# EAGLE design sensorandps (EAGLE 5.10)
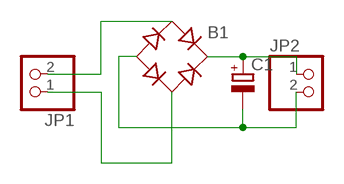
[diagram p0: schematic, sheet 1]

## Parts
B1  RB1A  [RB1A]
C1  CPOL-EUE7.5-16  [E7,5-16]
JP1  PINHD-1X2  [1X02]
JP2  PINHD-1X2  [1X02]

## Nets
N$1: B1.AC1 JP1.2
N$2: B1.AC2 JP1.1
N$3: B1.+ C1.+ JP2.1
N$4: B1.- C1.- JP2.2

## Library data of the parts
B1 = rectifier:RB1A: RECTIFIER 1 A
C1 = rcl:CPOL-EU: POLARIZED CAPACITOR, European symbol
JP1 JP2 = pinhead:PINHD-1X2: PIN HEADER

## Board
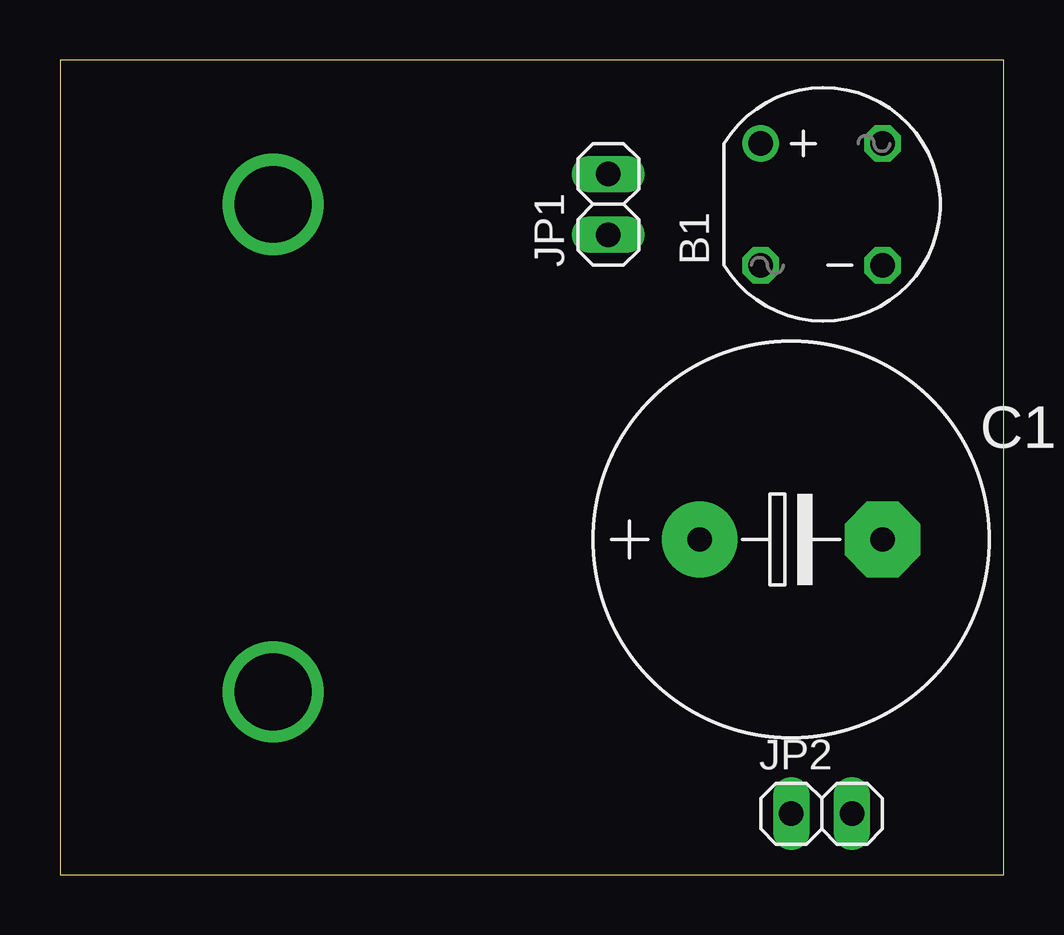
[diagram p1: board, top side]
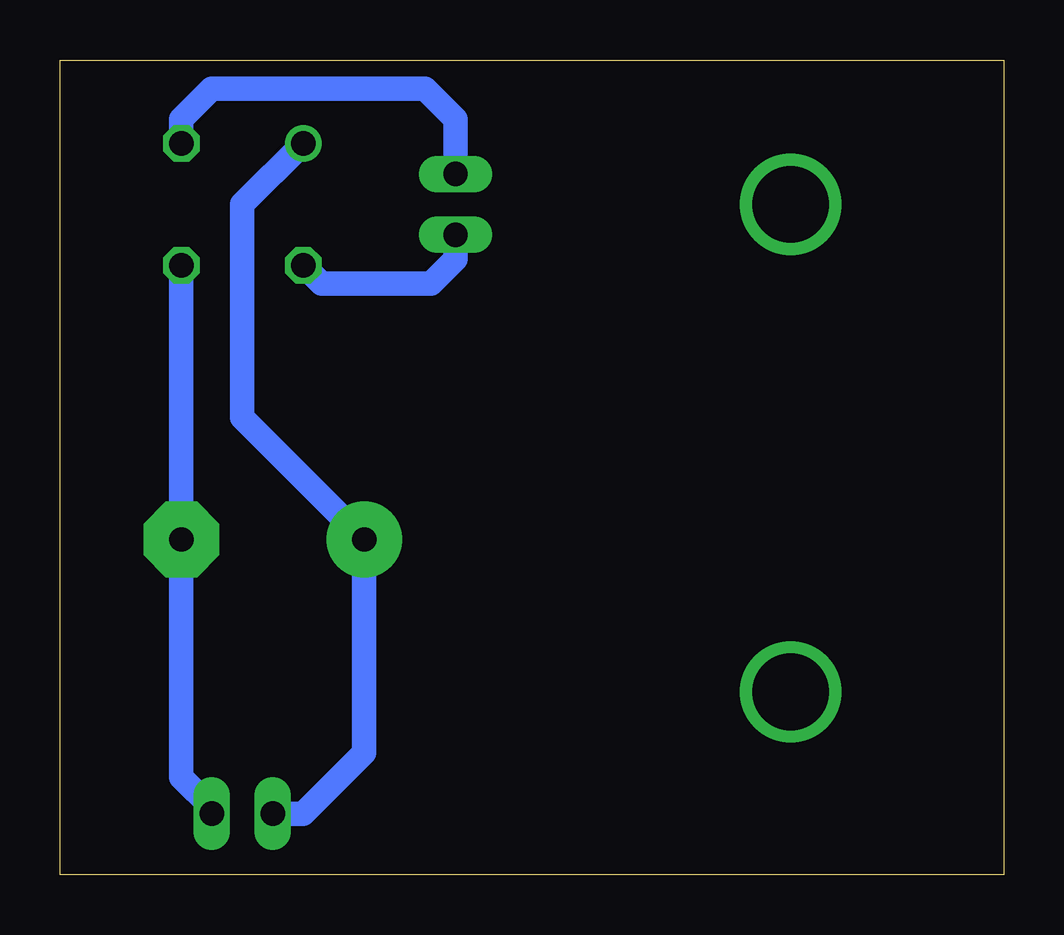
[diagram p2: board, bottom side, seen from below]

Size 39.35 x 33.96 mm. Coordinates in mm from the lower left corner, seen from the top.
Outline: 0,0 39.35,0 39.35,33.96 0,33.96 0,0
Copper layers (1*16): Top 0.035mm / dielectric 1.5mm / Bottom 0.035mm
Design rules "default": minimum track width 10mil, minimum drill 24mil, track to track 8mil, track to pad 8mil, pad to pad 8mil, via to via 8mil, smd to smd 8mil, copper to edge 40mil, drill to drill 8mil, minimum pad ring 10mil, minimum via ring 8mil, stop-mask expansion 4mil, vias tented up to drill 0mil, thermal gap 10mil

### Footprints (pad centres in the part's own frame; a part is rotated, then mirrored left to right if it is on the bottom)
RB1A = drill 1.016 round: + -2.54,2.54 | drill 1.016 octagon: - 2.54,-2.54; AC1 2.54,2.54; AC2 -2.54,-2.54
E7,5-16 = drill 1.016 pad 3.15 round: + -3.81,0 | drill 1.016 pad 3.15 octagon: - 3.81,0
1X02 = drill 1.016 long: 1 -1.27,0; 2 1.27,0

### Placement (x,y rotation side)
B1  31.75,27.94 0 top
C1  30.48,13.97 0 top
JP1  22.86,27.94 90 top
JP2  31.75,2.54 0 top

### Tracks (layer width: path | path; a pad name or v marks a point on that pad's centre or on a via)
N$1
  Bottom 1.016: JP1.2 22.86,31.5 24.13,32.77 33.02,32.77 34.29,31.5 B1.AC1
N$2
  Bottom 1.016: JP1.1 22.86,25.65 23.88,24.64 28.45,24.64 B1.AC2
N$3
  Bottom 1.016: B1.+ 31.75,27.94 31.75,19.05 C1.+ 26.67,5.08 29.21,2.54 JP2.1
N$4
  Bottom 1.016: B1.- C1.- 34.29,4.06 33.02,2.79 JP2.2
N$5  (via drill 3.2)
  other vias: 8.89,27.94
N$6  (via drill 3.2)
  other vias: 8.89,7.62